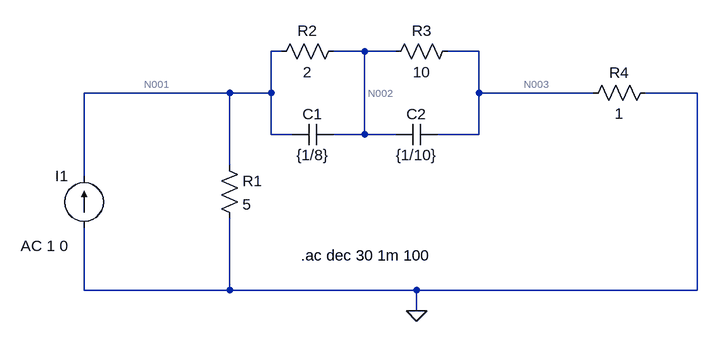
[diagram p0: schematic 1.asc]
1.asc, the LTspice schematic file:
Version 4
SHEET 1 880 680
WIRE 96 -48 80 -48
WIRE 224 -48 176 -48
WIRE 272 -48 224 -48
WIRE 400 -48 352 -48
WIRE 16 16 -208 16
WIRE 80 16 80 -48
WIRE 80 16 16 16
WIRE 400 16 400 -48
WIRE 576 16 400 16
WIRE 736 16 656 16
WIRE 80 80 80 16
WIRE 112 80 80 80
WIRE 224 80 224 -48
WIRE 224 80 176 80
WIRE 272 80 224 80
WIRE 400 80 400 16
WIRE 400 80 336 80
WIRE 16 128 16 16
WIRE -208 144 -208 16
WIRE -208 320 -208 224
WIRE 16 320 16 208
WIRE 16 320 -208 320
WIRE 304 320 16 320
WIRE 736 320 736 16
WIRE 736 320 304 320
WIRE 304 352 304 320
FLAG 304 352 0
SYMBOL res 0 112 R0
SYMATTR InstName R1
SYMATTR Value 5
SYMBOL cap 176 64 R90
WINDOW 0 0 32 VBottom 2
WINDOW 3 32 32 VTop 2
SYMATTR InstName C1
SYMATTR Value {1/8}
SYMBOL cap 336 64 R90
WINDOW 0 0 32 VBottom 2
WINDOW 3 32 32 VTop 2
SYMATTR InstName C2
SYMATTR Value {1/10}
SYMBOL res 192 -64 R90
WINDOW 0 0 56 VBottom 2
WINDOW 3 32 56 VTop 2
SYMATTR InstName R2
SYMATTR Value 2
SYMBOL res 368 -64 R90
WINDOW 0 0 56 VBottom 2
WINDOW 3 32 56 VTop 2
SYMATTR InstName R3
SYMATTR Value 10
SYMBOL res 672 0 R90
WINDOW 0 0 56 VBottom 2
WINDOW 3 32 56 VTop 2
SYMATTR InstName R4
SYMATTR Value 1
SYMBOL current -208 224 R180
WINDOW 0 24 80 Left 2
WINDOW 3 24 0 Left 2
WINDOW 123 24 -28 Left 2
WINDOW 39 0 0 Left 0
SYMATTR InstName I1
SYMATTR Value ""
SYMATTR Value2 AC 1 0
TEXT 126 266 Left 2 !.ac dec 30 1m 100

The netlist it stands for:
* 1.asc
R1 N001 0 5
C1 N002 N001 {1/8}
C2 N003 N002 {1/10}
R2 N002 N001 2
R3 N003 N002 10
R4 0 N003 1
I1 0 N001 AC 1 0
.ac dec 30 1m 100
.backanno
.end

* Results of the author's LTspice run, read from the files saved beside the schematic
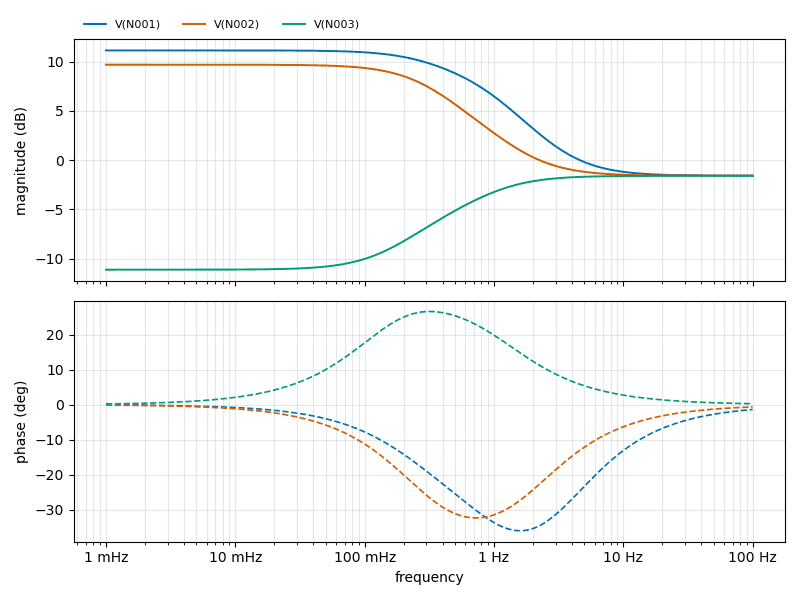
[diagram p1: AC Analysis of 1.asc, plotted from the saved traces]
* AC Analysis, 1 run:
*   V(N001): 11.15 dB at 1 mHz, -1.58 dB at 100 Hz, peak 11.15 dB at 1 mHz, 3 dB below the peak at 636.1 mHz
*   V(N002): 9.70 dB at 1 mHz, -1.58 dB at 100 Hz, peak 9.70 dB at 1 mHz, 3 dB below the peak at 384.9 mHz
*   V(N003): -11.13 dB at 1 mHz, -1.58 dB at 100 Hz, peak -1.58 dB at 100 Hz, 3 dB below the peak at 595.6 mHz